# EasyEDA schematic 2 Antenna Mini-Whip (SMD)_ Power feed unit.json
TITLE: Antenna Mini-Whip (SMD): Power feed unit; REV: 1.3.EE; Date: 2018-03-02; Sheet: 1/1; Drawn By: IgrikXD
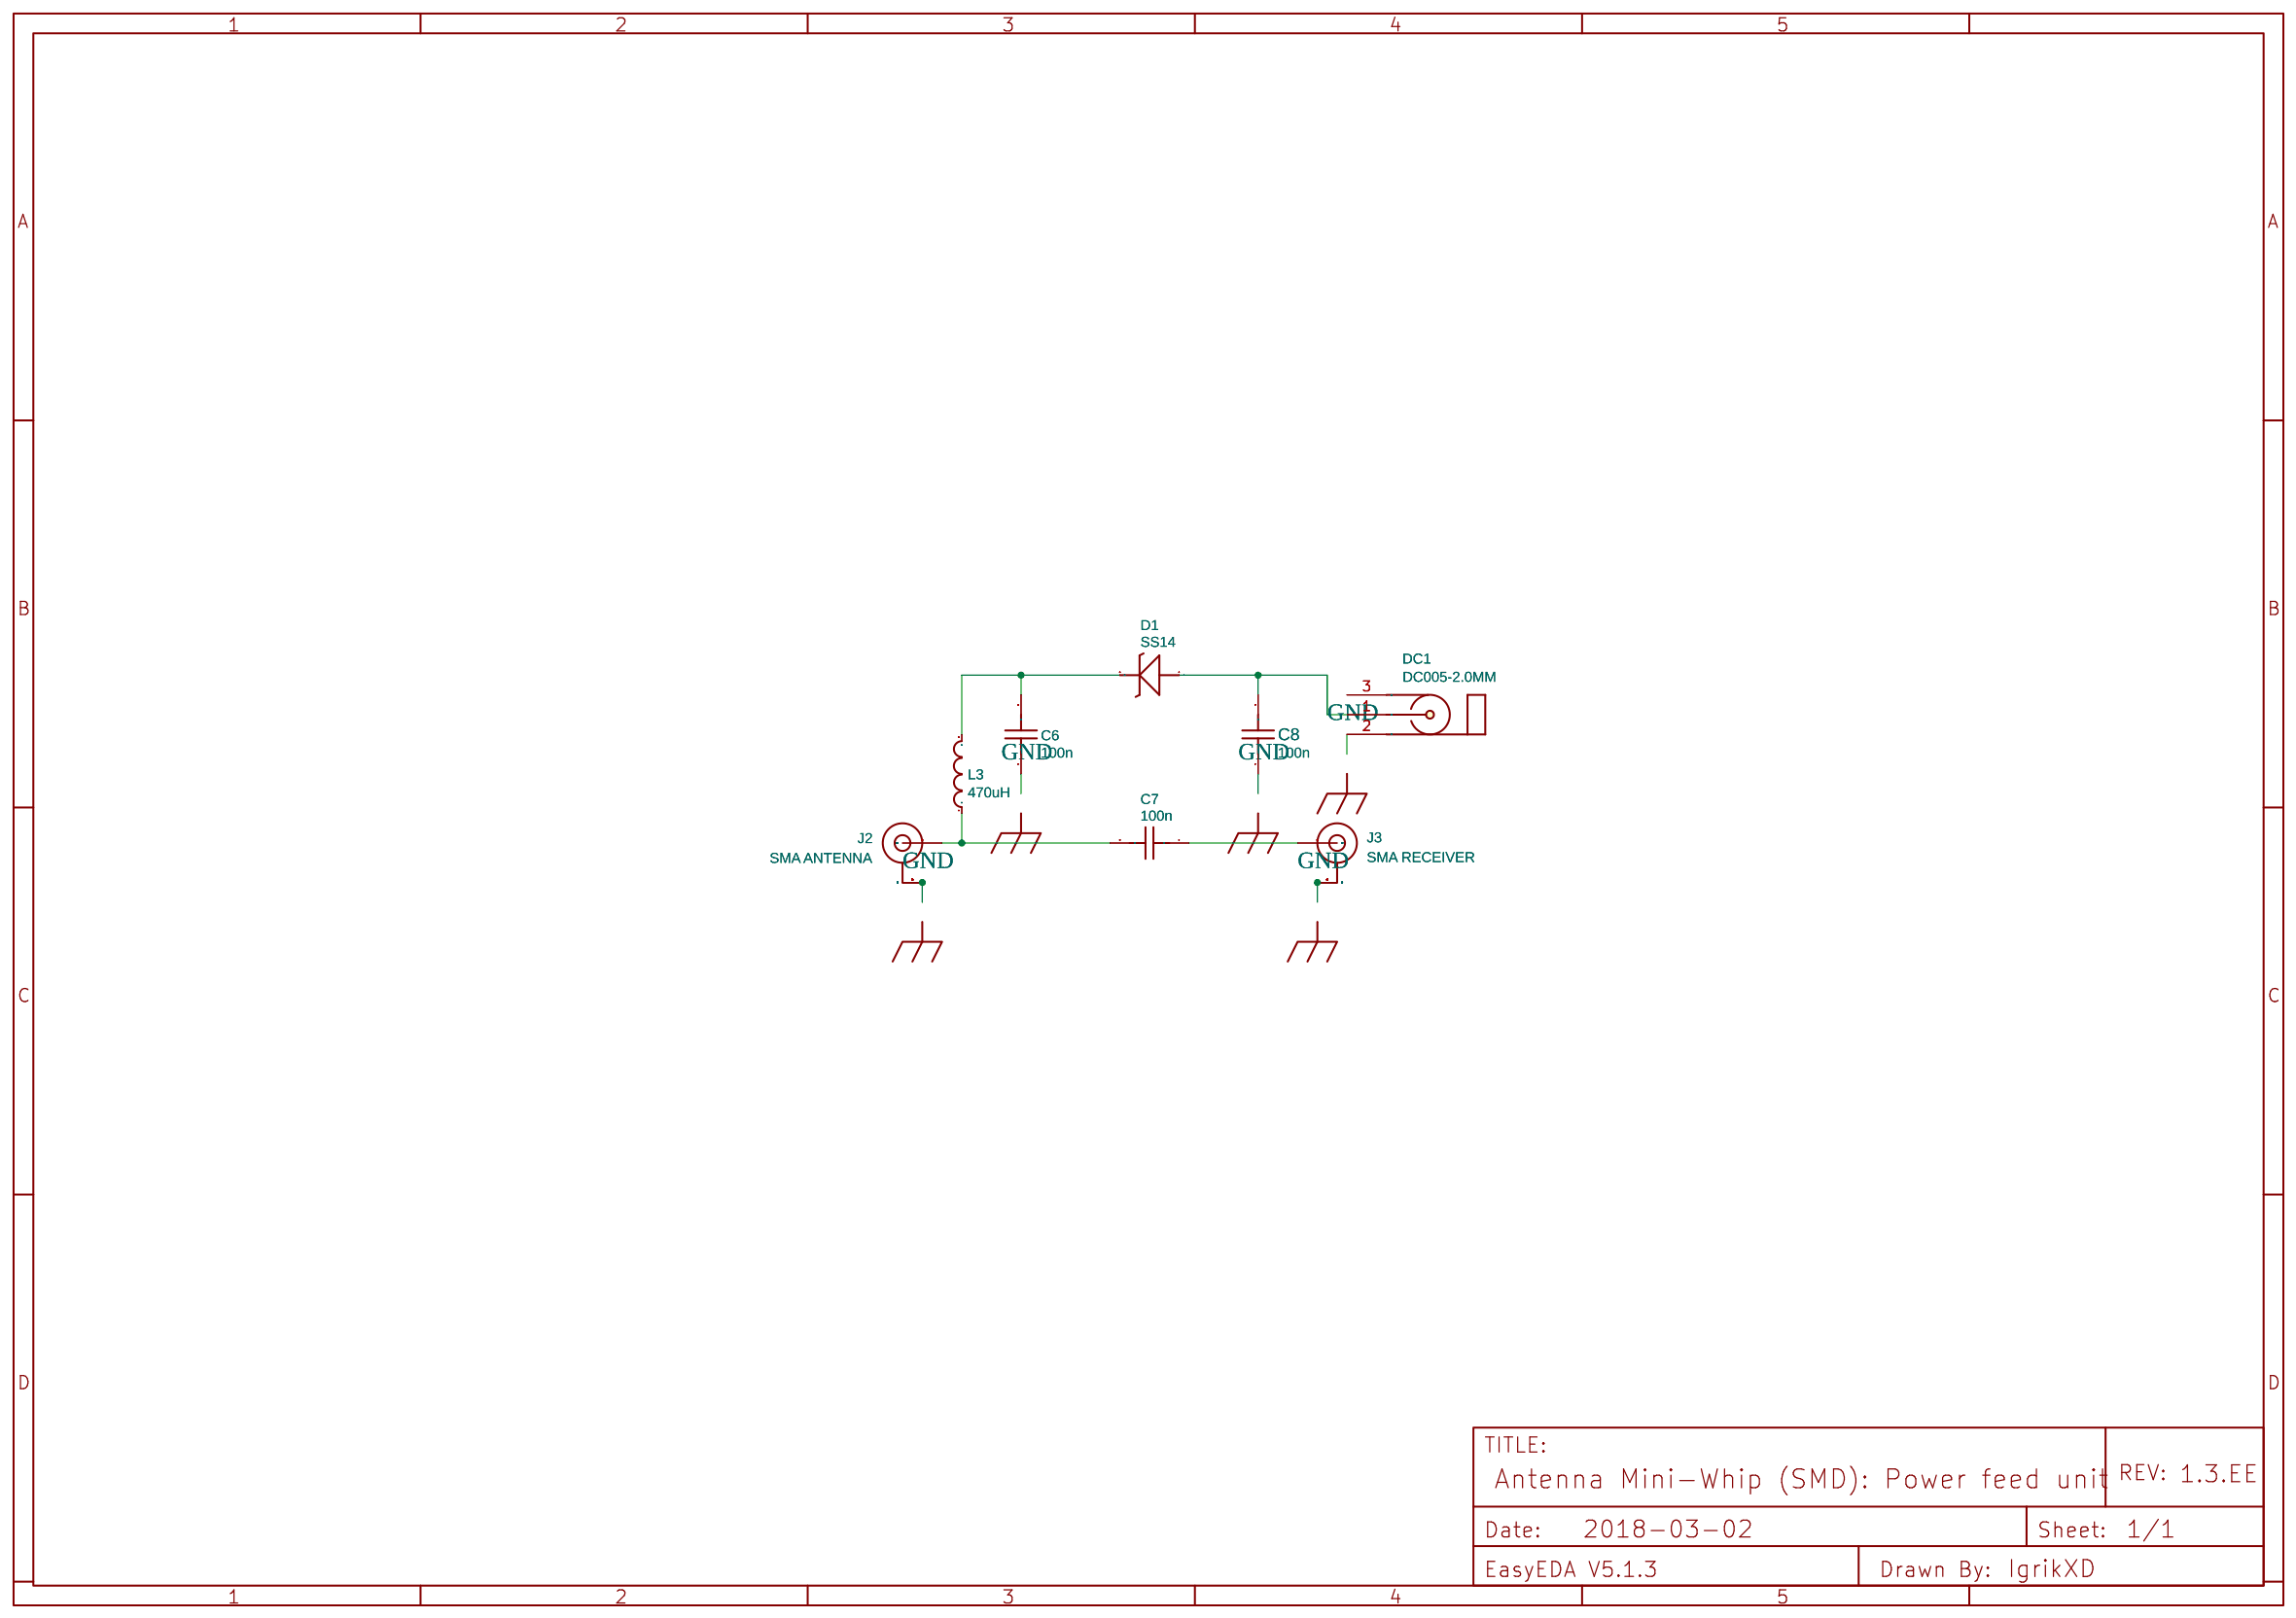
[diagram p0: schematic sheet]

## Parts
C6  100n  [0805]
C7  100n  [0805]
C8  100n  [0805]
D1  SS14  [DO214AC]
DC1  DC005-2.0MM  [DC-5020]
J2  SMA ANTENNA  [SMA-EDGE]
J3  SMA RECEIVER  [SMA-EDGE]
L3  470uH  [7850]

## Library data of the parts
C6-C8 = Capacitor: Manufacturer Part: 08055C104JAT2A; Supplier: LCSC; LCSC: C129175; Manufacturer: AVX
D1 = -: catid: 20; Contributor: SparkFun; Manufacturer Part: SS14-E3/61T; Supplier: LCSC; LCSC: C47460; Manufacturer: VISHAY
DC1 = -: Supplier: LCSC; Manufacturer: BOOMELE; Manufacturer Part: DC-005 5.5-2.0MM; LCSC: C16214
J2 J3 = -: SMA Antenna Connector; catid: 20; Contributor: Pinoccio; Manufacturer Part: CON-SMA-EDGE-S; Supplier: Digi-Key; Digi-Key: CON-SMA-EDGE-S-ND; Manufacturer: RF Solutions
L3 = -: Supplier: LCSC; Manufacturer: SXN; Manufacturer Part: SM7850-471MT; LCSC: C10158

## Nets
GND: C6.1 C8.1 DC1.2 J2.GND@0(GND) J2.GND@1(GND) J2.GND@2(GND) J2.GND@3(GND) J3.GND@0(GND) J3.GND@1(GND) J3.GND@2(GND) J3.GND@3(GND)
Net-(C6-2): C6.2 D1.2(C) L3.2
Net-(C7-1): C7.1 J3.SIG(SIGNAL)
Net-(C7-2): C7.2 J2.SIG(SIGNAL) L3.1
Net-(C8-2): C8.2 D1.1(A) DC1.1(VCC)

Not connected (* = marked no-connect by the designer): DC1 3
